# EasyEDA schematic SCH_H-brug_Jao.json
TITLE: PoC H-brug; REV: 1.0; Date: 15/12/2023; Sheet: 1/1; Drawn By: Jao Dekeyser; Company: HoGent
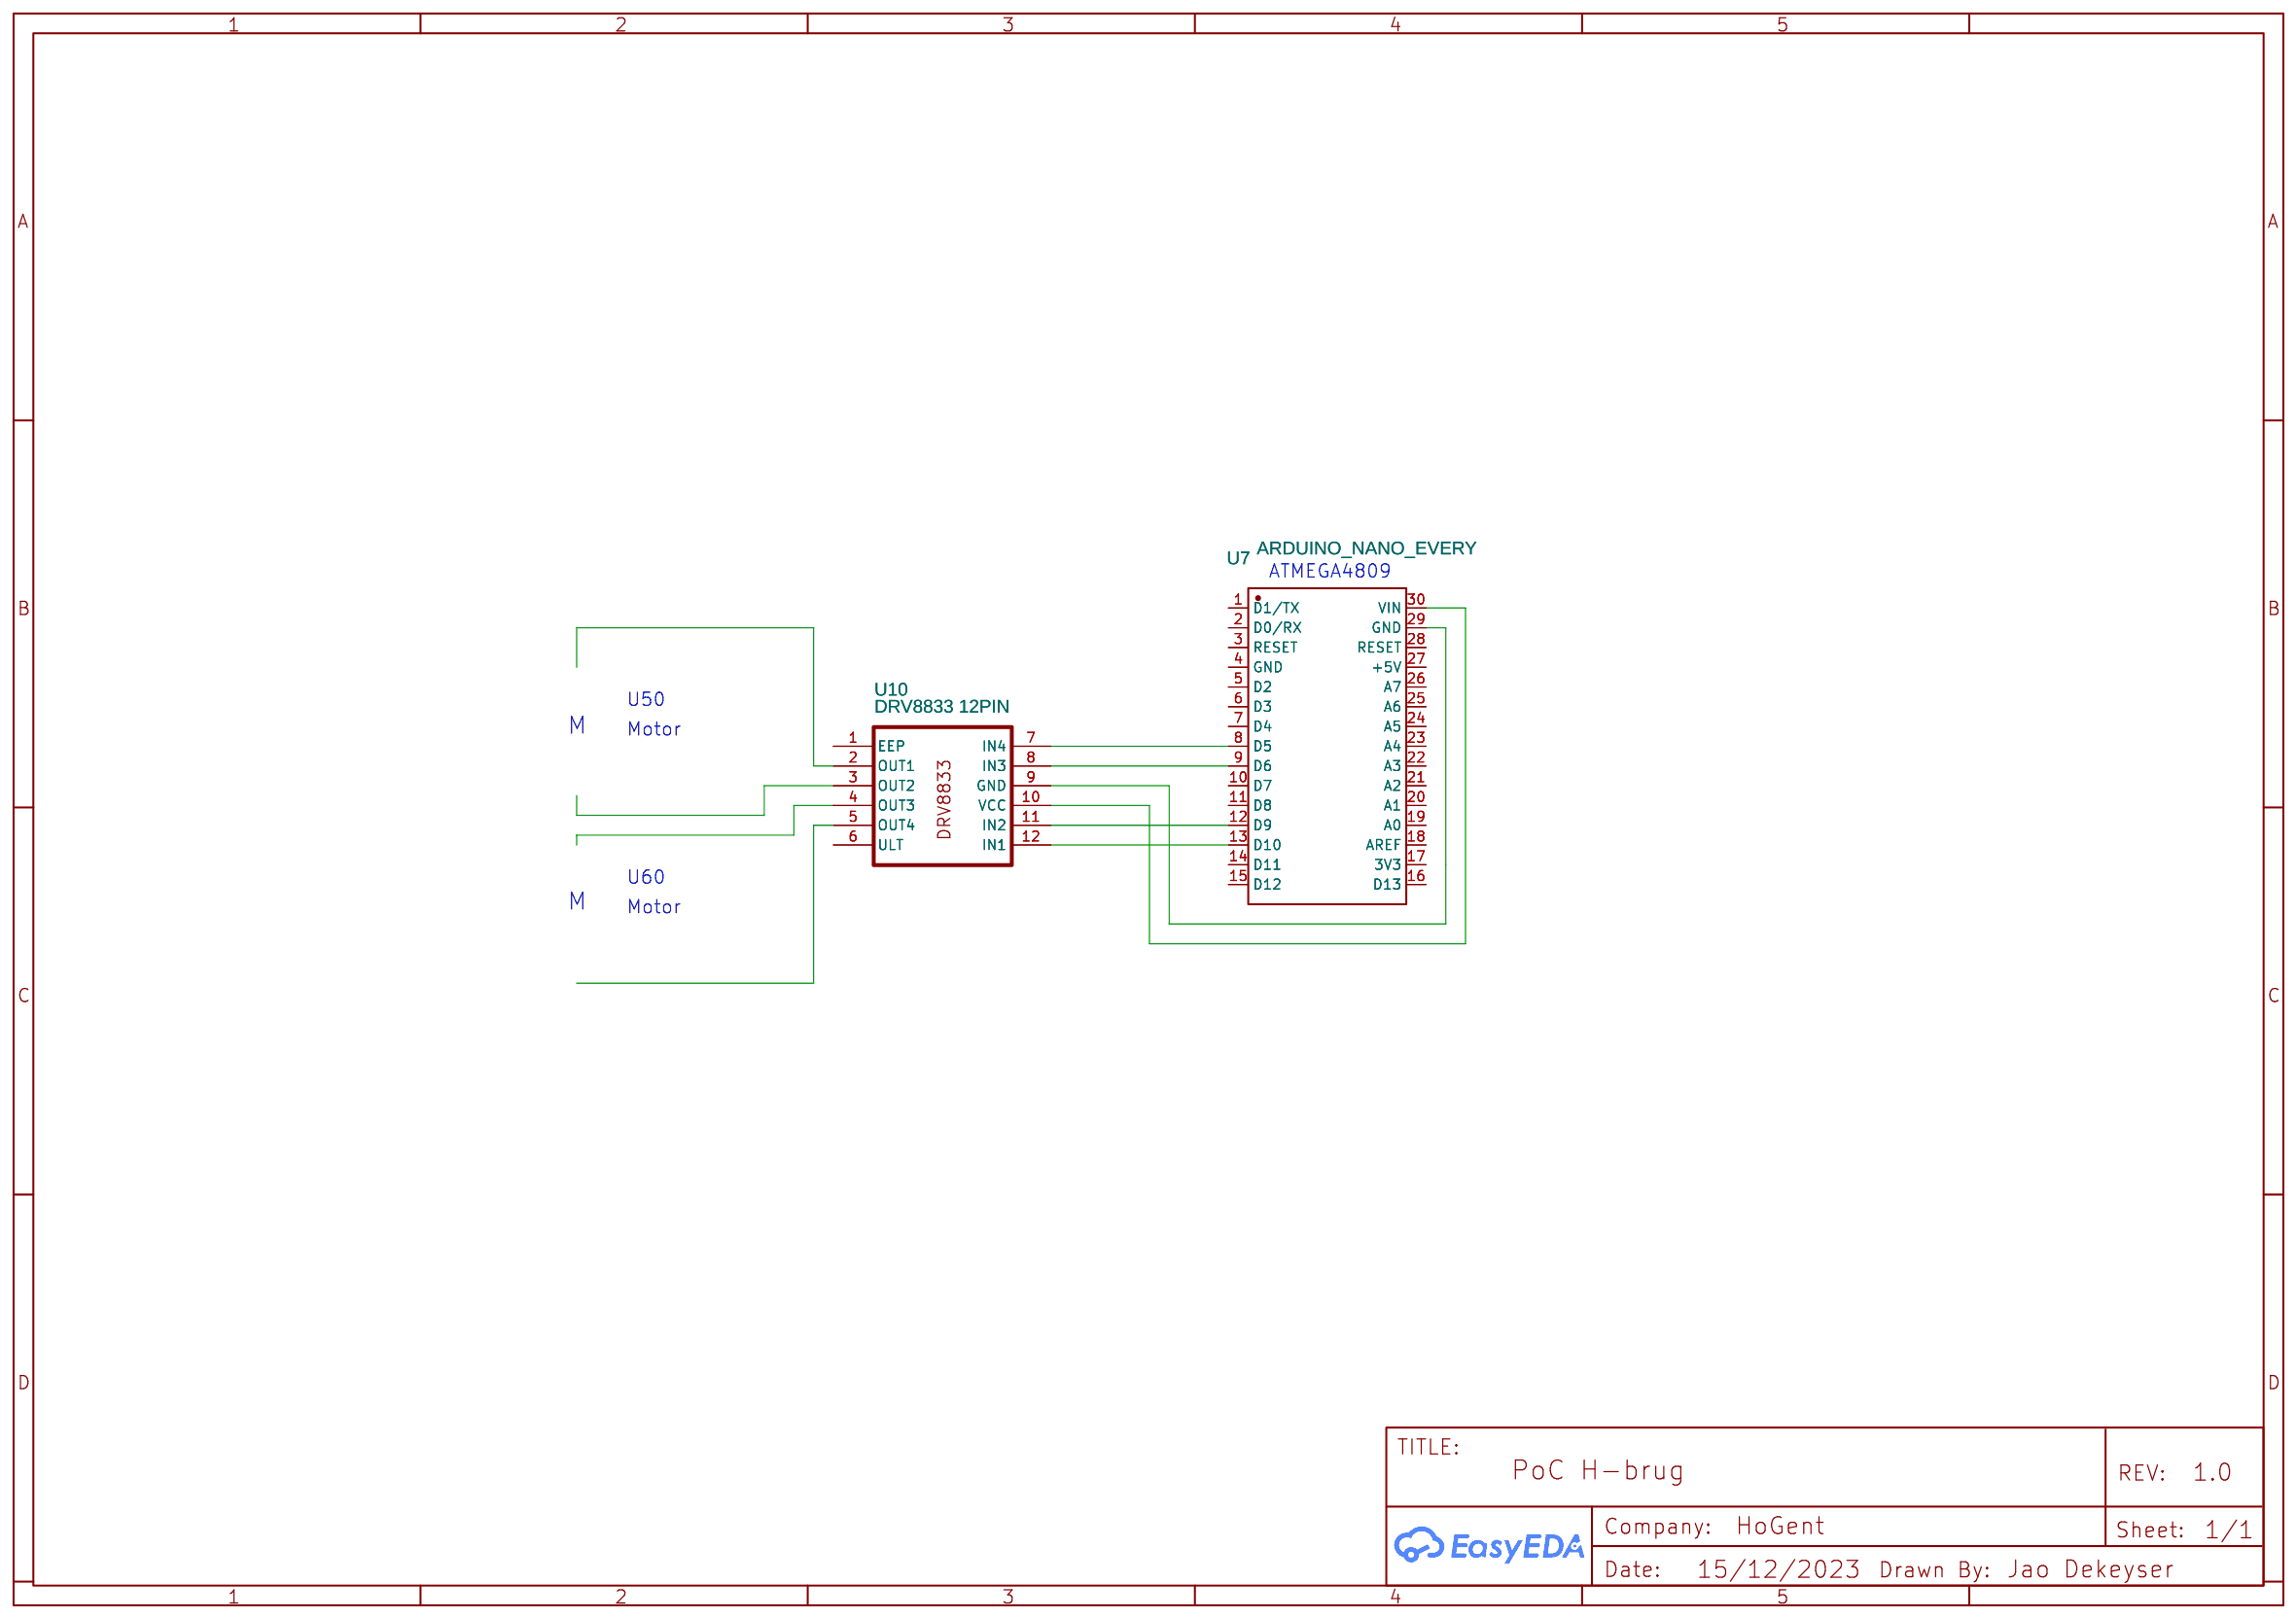
[diagram p0: schematic sheet]

## Parts
U7  ARDUINO_NANO_EVERY  [COMM-TH_ARDUINO_NANO]
U10  DRV8833 12PIN  [DRV8833 (NO ORIGINAL)]

## Library data of the parts
U7 = ARDUINO_NANO: Contributor: lcsc; Supplier: LCSC; Supplier Part: C9900017879; Manufacturer: null; JLCPCB Part Class: Extended Part; link: https://lcsc.com/eda_search?q=C9900017879&%26type=1&ref=editor
U10 = DRV8833 12PIN: Contributor: PiterSantaCruz

## Nets
Net-(U7-8): U7.8(D5) U10.7(IN4)
Net-(U7-9): U7.9(D6) U10.8(IN3)
Net-(U7-12): U7.12(D9) U10.11(IN2)
Net-(U7-13): U7.13(D10) U10.12(IN1)
Net-(U7-29): U7.29(GND) U10.9(GND)
Net-(U7-30): U7.30(VIN) U10.10(VCC)

Not connected (* = marked no-connect by the designer): U7 1(D1/TX) 2(D0/RX) 3(RESET) 4(GND) 5(D2) 6(D3) 7(D4) 10(D7) 11(D8) 14(D11) 15(D12) 16(D13) 17(3V3) 18(AREF) 19(A0) 20(A1) 21(A2) 22(A3) 23(A4) 24(A5) 25(A6) 26(A7) 27(+5V) 28(RESET); U10 1(EEP) 2(OUT1) 3(OUT2) 4(OUT3) 5(OUT4) 6(ULT)

## Notes on the sheet
- ATMEGA4809
- U50
- M
- Motor
- U60
- M
- Motor
